# EAGLE design refletancia (EAGLE 9.6.2)
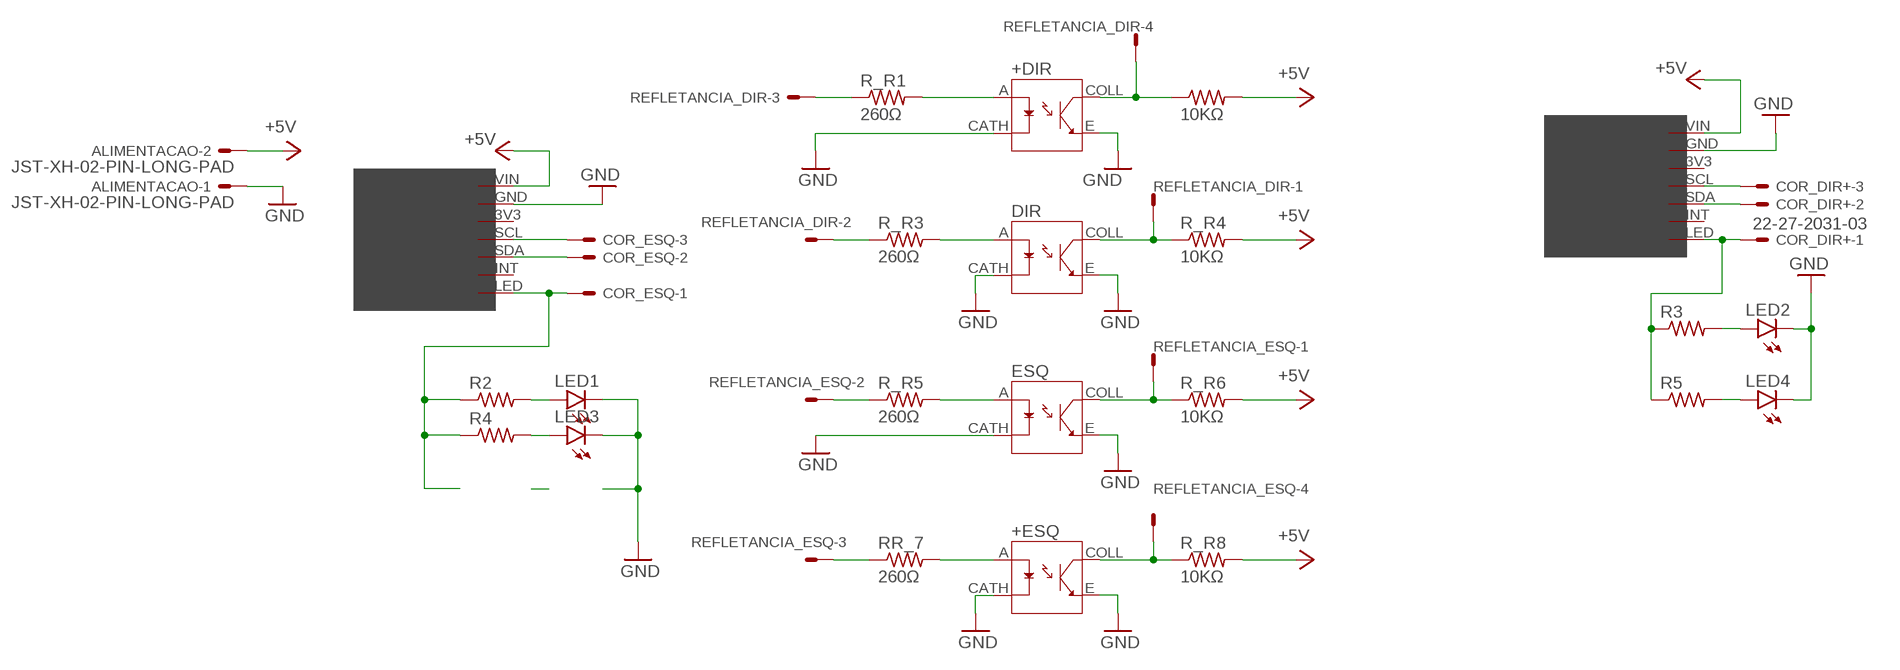
[diagram p0: schematic, sheet 1]

## Parts
+DIR  TCRT5000  [OPTO_TCRT5000]
+ESQ  TCRT5000  [OPTO_TCRT5000]
ALIMENTACAO  JST-XH-02-PIN-LONG-PAD  [JST-XH-02-PACKAGE-LONG-PAD]
COR_DIR+  22-27-2031-03  [6410-03]
COR_ESQ  22-27-2031-03  [6410-03]
DIR  TCRT5000  [OPTO_TCRT5000]
ESQ  TCRT5000  [OPTO_TCRT5000]
LED1  LED5MM  [LED5MM]
LED2  LED5MM  [LED5MM]
LED3  LEDCHIP-LED0805  [CHIP-LED0805]
LED4  LEDCHIP-LED0805  [CHIP-LED0805]
R2  R-US_0204/7  [0204/7]
R3  R-US_0204/7  [0204/7]
R4  R-US_0204/7  [0204/7]
R5  R-US_0204/7  [0204/7]
R_R1  260Ω  R-US_0204/7  [0204/7]
R_R2  10KΩ  R-US_0204/7  [0204/7]
R_R3  260Ω  R-US_0414/15_LONG_PAD  [0414/15_LOG_PAD]
R_R4  10KΩ  R-US_0204/7  [0204/7]
R_R5  260Ω  R-US_0204/7  [0204/7]
R_R6  10KΩ  R-US_0207/7_LONG_PAD2  [0207/7_LONG_PAD2]
R_R8  10KΩ  R-US_0204/7  [0204/7]
REFLETANCIA_DIR  JST-XH-04-PIN-LONG-PAD  [JST-XH-04-PACKAGE-LONG-PAD]
REFLETANCIA_ESQ  JST-XH-04-PIN-LONG-PAD  [JST-XH-04-PACKAGE-LONG-PAD]
RR_7  260Ω  R-US_0204/7  [0204/7]
U$1  TCS34725SEM_FUROS  [TCS34725_SEM_FUROS]
U$2  TCS34725SEM_FUROS  [TCS34725_SEM_FUROS]

## Nets
+5V: ALIMENTACAO.2 R_R2.2 R_R4.2 R_R6.2 R_R8.2 U$1.VIN U$2.VIN
ANALOG_+DIR.: +DIR.COLL R_R2.1 REFLETANCIA_DIR.4
ANALOG_+ESQ: +ESQ.COLL R_R8.1 REFLETANCIA_ESQ.4
ANALOG_DIR: DIR.COLL R_R4.1 REFLETANCIA_DIR.1
ANALOG_ESQ: ESQ.COLL R_R6.1 REFLETANCIA_ESQ.1
DIGITAL_+DIR.: R_R1.1 REFLETANCIA_DIR.3
DIGITAL_+ESQ: REFLETANCIA_ESQ.3 RR_7.1
DIGITAL_DIR: R_R3.1 REFLETANCIA_DIR.2
DIGITAL_ESQ: R_R5.1 REFLETANCIA_ESQ.2
GND: +DIR.CATH +DIR.E +ESQ.CATH +ESQ.E ALIMENTACAO.1 DIR.CATH DIR.E ESQ.CATH ESQ.E LED1.K(C) LED2.K(C) LED3.C LED4.C U$1.GND U$2.GND
N$1: +DIR.A R_R1.2
N$2: DIR.A R_R3.2
N$3: ESQ.A R_R5.2
N$4: +ESQ.A RR_7.2
N$7: COR_ESQ.1 R2.1 R4.1 U$1.LED
N$8: COR_ESQ.2 U$1.SDA
N$9: COR_ESQ.3 U$1.SCL
N$11: COR_DIR+.3 U$2.SCL
N$12: COR_DIR+.2 U$2.SDA
N$13: LED1.A R2.2
N$14: LED3.A R4.2
N$15: LED2.A R3.2
N$16: LED4.A R5.2
N$17: COR_DIR+.1 R3.1 R5.1 U$2.LED
Unconnected: U$1.3V3 U$1.INT U$2.3V3 U$2.INT

## Library data of the parts
+DIR +ESQ DIR ESQ = TCRT5000:TCRT5000: 950 nm 60 mA Through Hole Reflective Optical Sensor with Transistor Output Check availability <https://pricing.snapeda.com/parts/TCRT5000/Vishay/view-part?ref=eda>; AVAILABILITY: In Stock; DESCRIPTION: Reflective Optical Sensor 0.591 (15mm) PCB Mount; MF: Vishay; MP: TCRT5000; PACKAGE: TCRT5000 Vishay; PRICE: None; PURCHASE-URL: https://pricing.snapeda.com/search?q=TCRT5000&ref=eda
ALIMENTACAO = Rembrandt Electronics - JST XH Connectors v1-0:JST-XH-02-PIN: JST XH Connector 2 Pin Wire to board connector. Pitch: 2,54 mm, (0.100") Number of pins: 2 Created by Rembrandt Electronics www.rembrandtelectronics.com
COR_DIR+ COR_ESQ = con-molex:22-?-03: CONNECTOR wire to board 2.54 mm (.1 inch) pitch header; MF: MOLEX; OC_FARNELL: unknown; OC_NEWARK: unknown
LED1 LED2 = led_robotica:LED: LED OSRAM: - CHIPLED LG R971, LG N971, LY N971, LG Q971, LY Q971, LO R971, LY R971 LH N974, LH R974 LS Q976, LO Q976, LY Q976 LO Q996 - Hyper CHIPLED LW Q18S LB Q993, LB Q99A, LB R99A - SideLED LS A670, LO A670, LY A670, LG A670, LP A670 LB A673, LV A673, LT A673, LW A673 LH A674 LY A675 LS A676, LA A676, LO A676, LY A676, LW A676 LS A679, LY A679, LG A679 - Hyper Micro SIDELED® LS Y876, LA Y876, LO Y876, LY Y876 LT Y87S - SmartLED LW L88C, LW L88S LB L89C, LB L89S, LG L890 LS L89K, LO L89K, LY L89K LS L896, LA L896, LO L896, LY L896 - TOPLED LS T670, LO T670, LY T670, LG T670, LP T670 LSG T670, LSP T670, LSY T670, LOP T670, LYG T670 LG T671, LOG T671, LSG T671 LB T673, LV T673, LT T673, LW T673 LH T674 LS T676, LA T676, LO T676, LY T676, LB T676, LH T676, LSB T676, LW T676 LB T67C, LV T67C, LT T67C, LS T67K, LO T67K, LY T67K, LW E67C LS E67B, LA E67B, LO E67B, LY E67B, LB E67C, LV E67C, LT E67C LW T67C LS T679, LY T679, LG T679 LS T770, LO T770, LY T770, LG T770, LP T770 LB T773, LV T773, LT T773, LW T773 LH T774 LS E675, LA E675, LY E675, LS T675 LS T776, LA T776, LO T776, LY T776, LB T776 LHGB T686 LT T68C, LB T68C - Hyper Mini TOPLED® LB M676 - Mini TOPLED Santana® LG M470 LS M47K, LO M47K, LY M47K Source: http://www.osram.convergy.de LUXEON: - LUMILED® LXK2-PW12-R00, LXK2-PW12-S00, LXK2-PW14-U00, LXK2-PW14-V00 LXK2-PM12-R00, LXK2-PM12-S00, LXK2-PM14-U00 LXK2-PE12-Q00, LXK2-PE12-R00, LXK2-PE12-S00, LXK2-PE14-T00, LXK2-PE14-U00 LXK2-PB12-K00, LXK2-PB12-L00, LXK2-PB12-M00, LXK2-PB14-N00, LXK2-PB14-P00, LXK2-PB14-Q00 LXK2-PR12-L00, LXK2-PR12-M00, LXK2-PR14-Q00, LXK2-PR14-R00 LXK2-PD12-Q00, LXK2-PD12-R00, LXK2-PD12-S00 LXK2-PH12-R00, LXK2-PH12-S00 LXK2-PL12-P00, LXK2-PL12-Q00, LXK2-PL12-R00 Source: www.luxeon.com KINGBRIGHT: KA-3528ASYC Source: www.kingbright.com
LED3 LED4 = led:LED: LED OSRAM: - CHIPLED LG R971, LG N971, LY N971, LG Q971, LY Q971, LO R971, LY R971 LH N974, LH R974 LS Q976, LO Q976, LY Q976 LO Q996 - Hyper CHIPLED LW Q18S LB Q993, LB Q99A, LB R99A - SideLED LS A670, LO A670, LY A670, LG A670, LP A670 LB A673, LV A673, LT A673, LW A673 LH A674 LY A675 LS A676, LA A676, LO A676, LY A676, LW A676 LS A679, LY A679, LG A679 - Hyper Micro SIDELED® LS Y876, LA Y876, LO Y876, LY Y876 LT Y87S - SmartLED LW L88C, LW L88S LB L89C, LB L89S, LG L890 LS L89K, LO L89K, LY L89K LS L896, LA L896, LO L896, LY L896 - TOPLED LS T670, LO T670, LY T670, LG T670, LP T670 LSG T670, LSP T670, LSY T670, LOP T670, LYG T670 LG T671, LOG T671, LSG T671 LB T673, LV T673, LT T673, LW T673 LH T674 LS T676, LA T676, LO T676, LY T676, LB T676, LH T676, LSB T676, LW T676 LB T67C, LV T67C, LT T67C, LS T67K, LO T67K, LY T67K, LW E67C LS E67B, LA E67B, LO E67B, LY E67B, LB E67C, LV E67C, LT E67C LW T67C LS T679, LY T679, LG T679 LS T770, LO T770, LY T770, LG T770, LP T770 LB T773, LV T773, LT T773, LW T773 LH T774 LS E675, LA E675, LY E675, LS T675 LS T776, LA T776, LO T776, LY T776, LB T776 LHGB T686 LT T68C, LB T68C - Hyper Mini TOPLED® LB M676 - Mini TOPLED Santana® LG M470 LS M47K, LO M47K, LY M47K Source: http://www.osram.convergy.de LUXEON: - LUMILED® LXK2-PW12-R00, LXK2-PW12-S00, LXK2-PW14-U00, LXK2-PW14-V00 LXK2-PM12-R00, LXK2-PM12-S00, LXK2-PM14-U00 LXK2-PE12-Q00, LXK2-PE12-R00, LXK2-PE12-S00, LXK2-PE14-T00, LXK2-PE14-U00 LXK2-PB12-K00, LXK2-PB12-L00, LXK2-PB12-M00, LXK2-PB14-N00, LXK2-PB14-P00, LXK2-PB14-Q00 LXK2-PR12-L00, LXK2-PR12-M00, LXK2-PR14-Q00, LXK2-PR14-R00 LXK2-PD12-Q00, LXK2-PD12-R00, LXK2-PD12-S00 LXK2-PH12-R00, LXK2-PH12-S00 LXK2-PL12-P00, LXK2-PL12-Q00, LXK2-PL12-R00 Source: www.luxeon.com KINGBRIGHT: KA-3528ASYC Source: www.kingbright.com
R2-R5 R_R1 R_R2 R_R4 R_R5 R_R8 RR_7 = rcl_robotica:R-US_: RESISTOR, American symbol; SPICEPREFIX: R
R_R3 R_R6 = rcl_vitoria:R-US_: RESISTOR, American symbol
REFLETANCIA_DIR REFLETANCIA_ESQ = Rembrandt Electronics - JST XH Connectors v1-0:JST-XH-04-PIN: JST XH Connector 2 Pin Wire to board connector. Pitch: 2,54 mm, (0.100") Number of pins: 4 Created by Rembrandt Electronics www.rembrandtelectronics.com
U$1 U$2 = TCS34725:TCS34725: Sensor RGB TCS34725

## Board
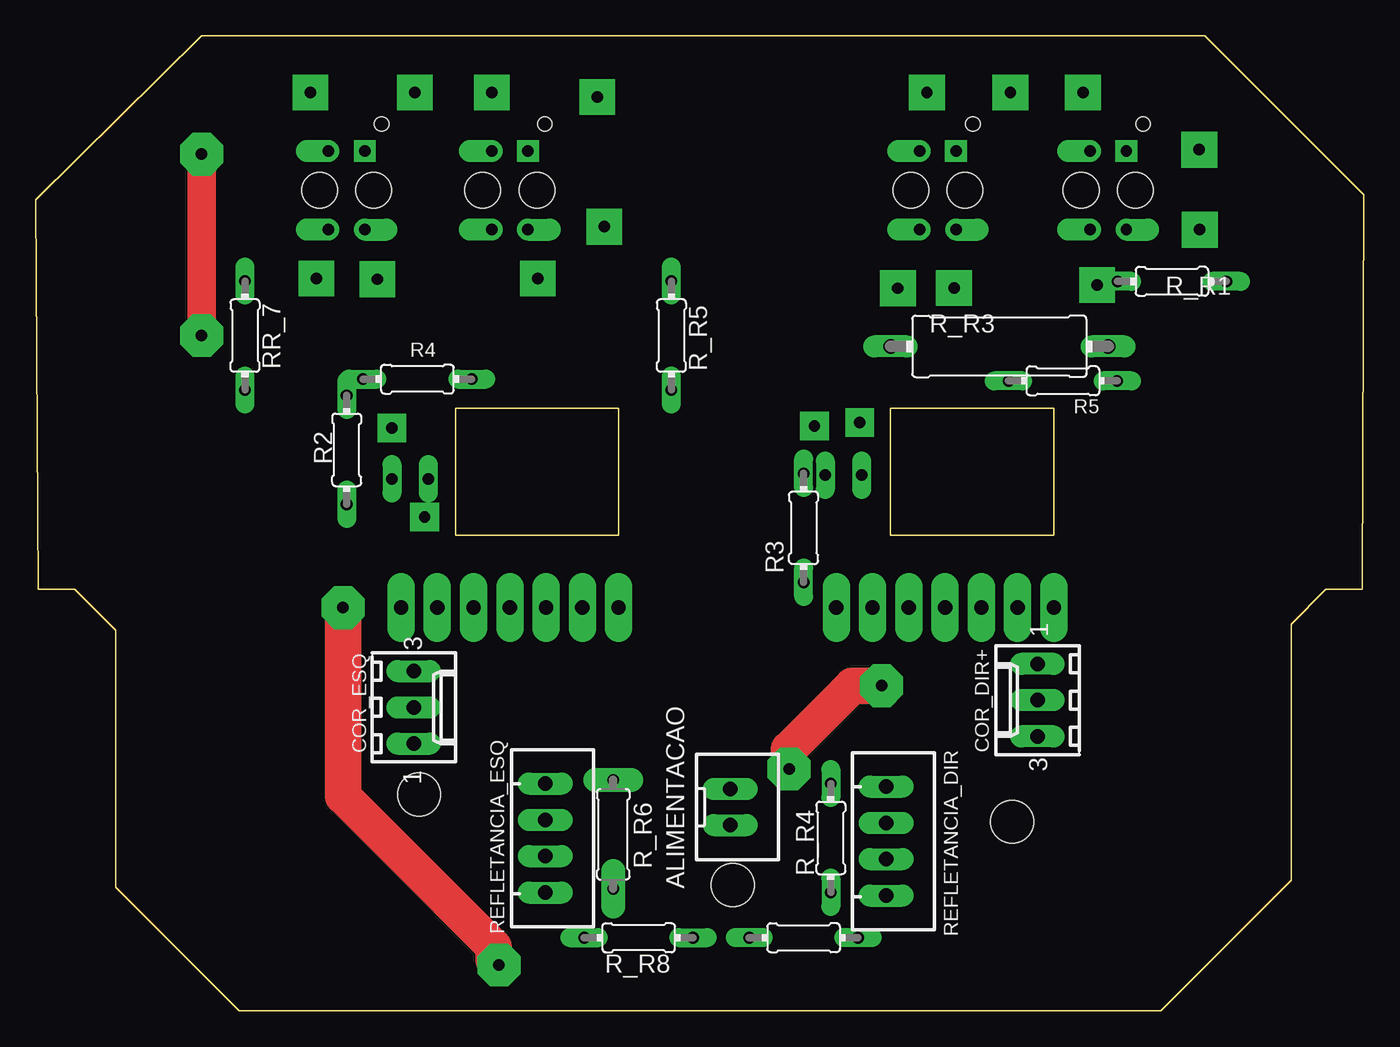
[diagram p1: board, top side]
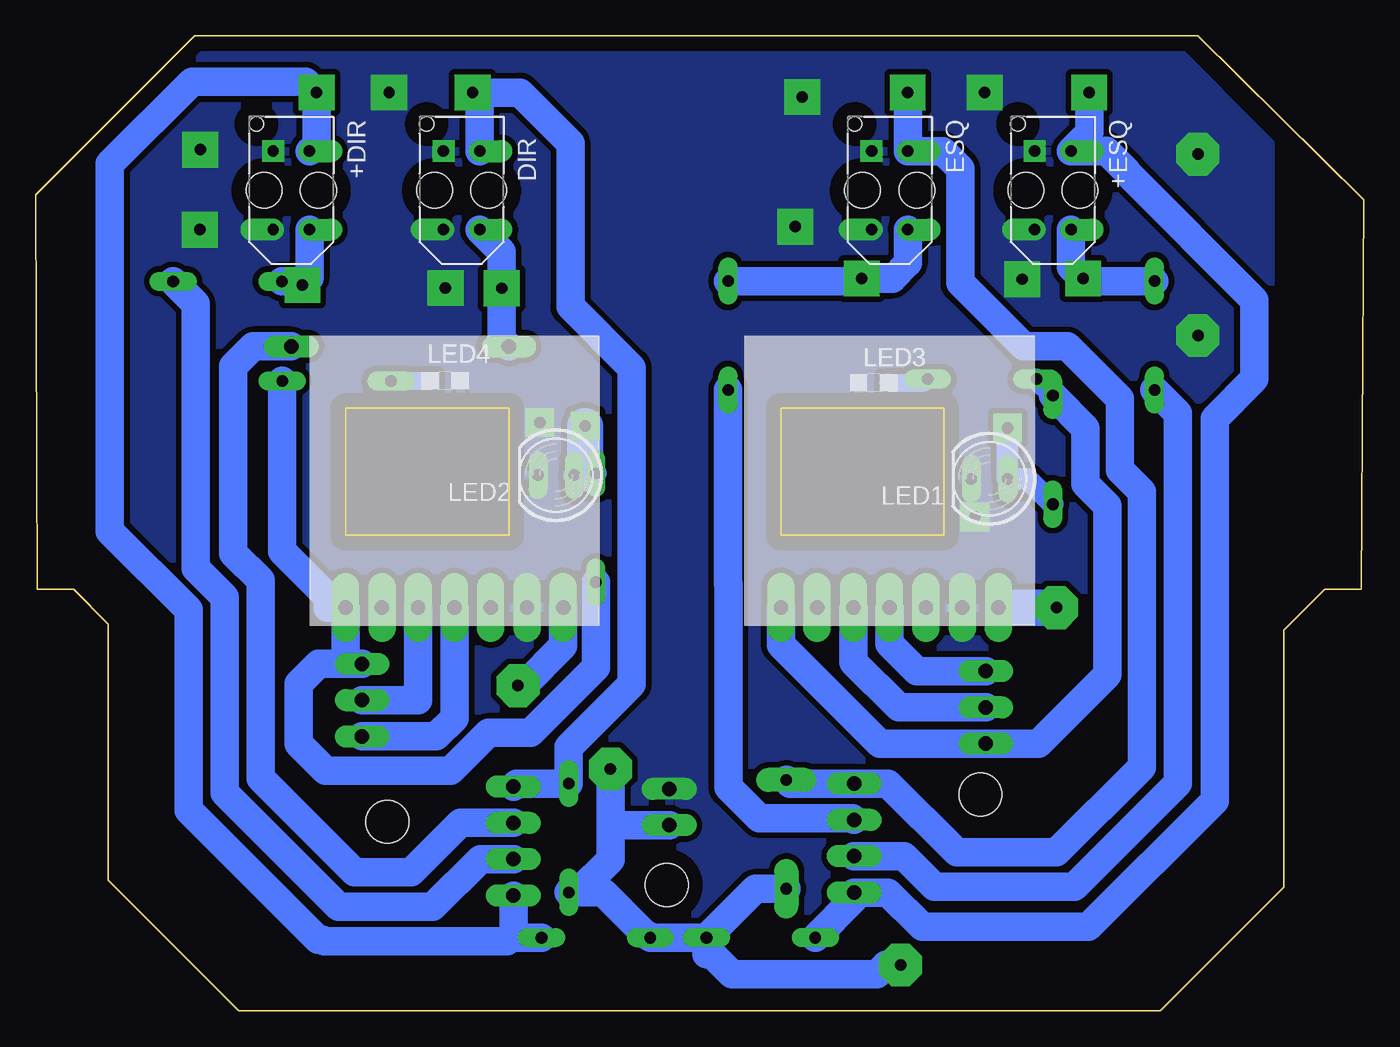
[diagram p2: board, bottom side, seen from below]

Size 93.02 x 68.27 mm. Coordinates in mm from the lower left corner, seen from the top.
Outline: 87.94,9.15 87.94,27.08 90.36,29.5 92.9,29.5 93.02,57.15 81.9,68.27 11.63,68.27 0,56.77 0.19,29.5 2.73,29.5 5.59,26.64 5.59,8.65 14.24,0 78.79,0 87.94,9.15
Outline: 40.83,33.31 40.83,42.2 29.4,42.2 29.4,33.31 40.83,33.31
Outline: 71.31,33.31 71.31,42.2 59.88,42.2 59.88,33.31 71.31,33.31
Copper layers (1*16): Top 0.035mm / dielectric 1.5mm / Bottom 0.035mm
Design rules "default *": minimum track width 6mil, minimum drill 0.35mm, track to track 16mil, track to pad 16mil, pad to pad 16mil, via to via 16mil, smd to smd 6mil, copper to edge 40mil, drill to drill 6mil, minimum pad ring 10mil, minimum via ring 8mil, stop-mask expansion 4mil, vias tented up to drill 0mil, thermal gap 0mil
Holes 3 mm at 26.86,15.15 48.83,8.8 68.39,13.24

### Footprints (pad centres in the part's own frame; a part is rotated, then mirrored left to right if it is on the bottom)
OPTO_TCRT5000 = drill 0.8 pad 1.524 offset: A 2.75,1.27; CATH 2.75,-1.27; COLL -2.75,1.27 | drill 0.8 pad 1.524 square: E -2.75,-1.27 | hole 1: -4.65,-2.45 | hole 2.5: 0,-1.9; 0,1.9
JST-XH-02-PACKAGE-LONG-PAD = drill 1.016 long: 1 -1.27,0; 2 1.27,0
6410-03 = drill 1.016 long: 1 2.54,0; 2 0,0; 3 -2.54,0
LED5MM = drill 0.813 long: A -1.27,0; K 1.27,0
CHIP-LED0805 = smd 1.2 x 1.2: A 0,-1.05; C 0,1.05
0204/7 = drill 0.813 long: 1 -3.81,0; 2 3.81,0
0414/15_LOG_PAD = drill 1.016 long: 1 -7.62,0; 2 7.62,0
0207/7_LONG_PAD2 = drill 0.813 pad 1.676 long: 1 -3.81,0; 2 3.81,0
JST-XH-04-PACKAGE-LONG-PAD = drill 1.016 long: 1 -3.81,0; 2 -1.27,0; 3 1.27,0; 4 3.81,0
TCS34725_SEM_FUROS = drill 1 pad 1.93 long: 3V3 12.7,1.27; GND 15.24,1.27; INT 5.08,1.27; LED 2.54,1.27; SCL 10.16,1.27; SDA 7.62,1.27; VIN 17.78,1.27

### Placement (x,y rotation side)
+DIR  75.12,57.44 270 bottom
+ESQ  21.78,57.44 270 bottom
ALIMENTACAO  48.64,14.27 270 top
COR_DIR+  70.16,21.75 90 top
COR_ESQ  26.48,21.24 270 top
DIR  63.19,57.44 270 bottom
ESQ  33.21,57.44 270 bottom
LED1  26.22,37.25 180 bottom
LED2  56.58,37.5 180 bottom
LED3  34.35,43.98 90 bottom
LED4  64.32,44.11 270 bottom
R2  21.78,39.28 270 top
R3  53.78,33.82 90 top
R4  26.73,44.23 0 top
R5  71.94,44.11 180 top
R_R1  79.58,51.07 180 top
R_R2  53.78,5.12 180 top
R_R3  67.49,46.52 180 top
R_R4  55.69,12.1 270 top
R_R5  44.53,47.28 90 top
R_R6  40.45,12.35 270 top
R_R8  42.23,5.12 0 top
REFLETANCIA_DIR  59.56,11.88 270 top
REFLETANCIA_ESQ  35.69,12.09 270 top
RR_7  14.66,47.28 90 top
U$1  43.37,26.96 0 bottom
U$2  73.85,26.96 0 bottom

### Tracks (layer width: path | path; a pad name or v marks a point on that pad's centre or on a via)
+5V  (via drill 0.8 pad 3)
  Top 2.54: v21.52,28.23 21.52,15.02 32.06,4.48 32.06,3.59 v32.45,3.21 | v59.24,22.77 57.21,22.77 52.77,18.32 v52.77,16.93
  Bottom 1.27: 24.32,28.23 U$1.VIN
  Bottom 2: v32.45,3.21 33.46,3.21 34.1,2.58 44.26,2.58 45.65,3.97 46.04,3.97 R_R8.2 | 52.77,12.99 52.77,10.58 55.05,8.29 R_R4.2 53.29,8.29 50.29,5.28 50.14,5.28 R_R2.2 R_R8.2 | 52.77,12.99 ALIMENTACAO.2 | v59.24,22.77 58.86,22.77 56.07,25.56 U$2.VIN | R_R6.2 42.61,8.54 R_R8.2 | v52.77,16.93 52.77,12.99
  Bottom 2.54: v21.52,28.23 24.32,28.23
ANALOG_+DIR.  (via drill 0.8 pad 2.5)
  Bottom 2: R_R2.1 59.37,5.12 59.56,5.31 | +DIR.COLL 73.35,60.69 v73.35,64.29 74.12,65.06 82.06,65.06 87.82,59.3 87.82,33.57 82.31,28.06 82.31,14.04 73.24,4.96 72.91,4.96 72.81,4.87 60,4.87 59.56,5.31 | REFLETANCIA_DIR.4 59.56,5.31
ANALOG_+ESQ  (via drill 0.8 pad 2.5)
  Bottom 2: v19.24,64.29 19.24,61.46 +ESQ.COLL 18.09,60.19 18.05,60.23 16.61,58.79 16.61,58.71 7.65,49.75 7.65,44.26 10.45,41.47 10.45,14.71 19.28,5.88 30.92,5.88 33.33,8.28 REFLETANCIA_ESQ.4 35.69,7.84 R_R8.1
ANALOG_DIR  (via drill 0.8 pad 2.5)
  Bottom 2: DIR.COLL 61.92,63.79 v62.42,64.29 59.11,64.29 55.56,60.74 55.56,49.31 51.28,45.03 51.28,22.86 55.69,18.45 R_R4.1 59.34,15.91 REFLETANCIA_DIR.1
ANALOG_ESQ  (via drill 0.8 pad 2.5)
  Bottom 2: v31.94,64.29 ESQ.COLL 29.48,60.19 28.26,58.96 28.26,50.96 23.81,46.52 20.76,46.52 17.09,42.84 17.09,37.88 15.56,36.35 15.56,17.05 21.53,11.08 28.51,11.08 33.33,15.9 REFLETANCIA_ESQ.1 40.19,15.9 R_R6.1
DIGITAL_+DIR.
  Bottom 2: REFLETANCIA_DIR.3 61.87,10.61 65.21,7.27 71.82,7.27 79.79,15.25 79.79,28.97 81.82,31 81.82,49.5 R_R1.1
DIGITAL_+ESQ
  Bottom 2: RR_7.1 13.03,41.84 13.03,15.92 20.27,8.67 30.06,8.67 32.2,10.82 REFLETANCIA_ESQ.3
DIGITAL_DIR
  Bottom 2: REFLETANCIA_DIR.2 63.25,13.15 66.71,9.69 70.67,9.69 77.28,16.29 77.28,30.13 79.17,32.03 79.17,45.13 77.78,46.52 R_R3.1
DIGITAL_ESQ
  Bottom 2: REFLETANCIA_ESQ.2 35.81,13.48 42.34,13.48 44.5,15.65 44.5,29.87 44.53,29.9 R_R5.1
GND  (via drill 0.8 pad 2, 0.8 pad 2.5, 0.8 pad 3)
  Top 2: v11.62,59.98 v11.62,47.28
  other vias: 27.24,34.58 81.49,60.29 81.53,54.69 68.27,64.29 64.31,50.61 39.83,54.9 39.33,63.98 26.55,64.29 23.94,51.22 57.72,41.18
  pour Bottom: 86.55,64.83 83.47,67.91 13.7,67.91 6.54,60.75 6.54,33.16 34.62,5.08 83.41,5.08 86.55,8.21
N$1  (via drill 0.8 pad 2.5)
  Bottom 2: 74.6,50.57 v74.35,50.82 74.1,51.07 | 74.1,51.07 73.85,51.32 +DIR.A | R_R1.2 74.1,51.07
N$2  (via drill 0.8 pad 2.5)
  Bottom 2: DIR.A 60.39,53.16 v60.39,50.59 60.39,47.03 R_R3.2
N$3  (via drill 0.8 pad 2.5)
  Bottom 2: ESQ.A 31.94,52.36 33.03,51.27 v35.17,51.27 35.35,51.09 R_R5.2
N$4  (via drill 0.8 pad 2.5)
  Bottom 2: +ESQ.A 20.51,52.11 v19.67,51.27 19.49,51.09 RR_7.2
N$7
  Bottom 1.5: R4.1 R2.1
  Bottom 2: R2.1 19.49,40.8 19.49,36.88 17.96,35.36 17.96,23.53 22.79,18.7 COR_ESQ.1 33.89,18.7 40.83,25.64 U$1.LED
N$8
  Bottom 2: COR_ESQ.2 32.57,21.24 35.75,24.42 U$1.SDA
N$9
  Bottom 2: COR_ESQ.3 31.3,23.78 33.21,25.69 U$1.SCL
N$11
  Bottom 2: COR_DIR+.3 64.96,19.21 63.69,20.48 U$2.SCL
N$12
  Bottom 2: COR_DIR+.2 66.23,21.75 U$2.SDA
N$13  (via drill 0.8 pad 2)
  Bottom 1.5: R2.2 23.56,37.25 LED1.A v24.95,40.8
N$14
  Bottom 1.27: LED3.A 30.8,43.98 R4.2
N$15  (via drill 0.8 pad 2)
  Bottom 1: 54.54,37.63 54.67,37.5 LED2.A
  Bottom 1.5: LED2.A 55.18,37.63 R3.2
  Bottom 2.54: v54.54,40.93 54.54,37.63
N$16
  Bottom 1.27: R5.2 LED4.A
N$17
  Bottom 1.27: U$2.LED 72.58,28.23
  Bottom 2: 72.58,28.23 72.58,28.99 75.75,32.17 R5.1 | U$2.LED 71.31,24.29 COR_DIR+.1 73.21,24.29 74.61,22.9 74.61,18.7 72.71,16.81 63.96,16.81 61.3,19.47 58.35,19.47 53.78,24.04 R3.1